# EAGLE design berry_4.0 (EAGLE 6.5.0)
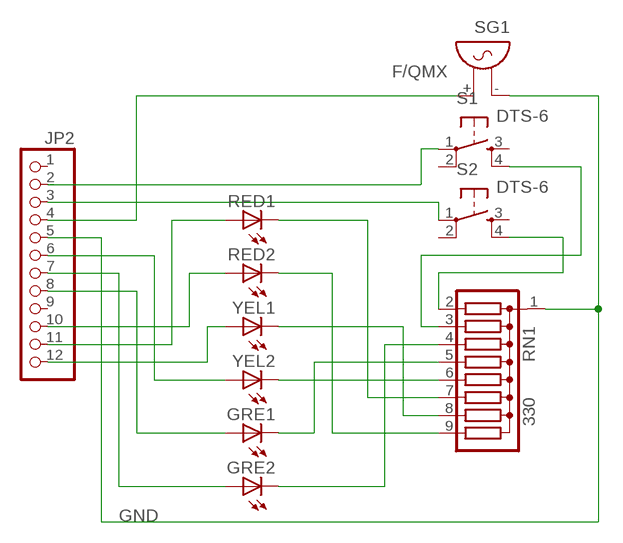
[diagram p0: schematic, sheet 1]

## Parts
GRE1  LED3MM  [LED3MM]
GRE2  LED3MM  [LED3MM]
JP2  PINHD-1X12  [1X12]
RED1  LED3MM  [LED3MM]
RED2  LED3MM  [LED3MM]
RN1  330  G08R  [SIL9]
S1  DTS-6  [DTS-6]
S2  DTS-6  [DTS-6]
SG1  F/QMX  [F/QMX]
YEL1  LED3MM  [LED3MM]
YEL2  LED3MM  [LED3MM]

## Nets
GND: JP2.5 RN1.1 SG1.-
N$1: GRE1.K(C) RN1.5
N$2: JP2.2 S1.1
N$4: RN1.8 YEL1.K(C)
N$6: JP2.10 RED2.A
N$7: RN1.6 YEL2.K(C)
N$8: RED2.K(C) RN1.9
N$9: JP2.4 SG1.+
N$10: RED1.K(C) RN1.7
N$12: GRE2.K(C) RN1.4
N$13: GRE2.A JP2.7
N$14: GRE1.A JP2.8
N$15: RN1.2 S2.4
N$16: RN1.3 S1.4
N$17: JP2.11 RED1.A
N$18: JP2.3 S2.1
N$19: JP2.6 YEL2.A
N$20: JP2.12 YEL1.A
Unconnected: JP2.1 JP2.9 S1.2 S1.3 S2.2 S2.3

## Library data of the parts
GRE1 GRE2 RED1 RED2 YEL1 YEL2 = led:LED: LED OSRAM: - CHIPLED LG R971, LG N971, LY N971, LG Q971, LY Q971, LO R971, LY R971 LH N974, LH R974 LS Q976, LO Q976, LY Q976 LO Q996 - Hyper CHIPLED LW Q18S LB Q993, LB Q99A, LB R99A - SideLED LS A670, LO A670, LY A670, LG A670, LP A670 LB A673, LV A673, LT A673, LW A673 LH A674 LY A675 LS A676, LA A676, LO A676, LY A676, LW A676 LS A679, LY A679, LG A679 - Hyper Micro SIDELED® LS Y876, LA Y876, LO Y876, LY Y876 LT Y87S - SmartLED LW L88C, LW L88S LB L89C, LB L89S, LG L890 LS L89K, LO L89K, LY L89K LS L896, LA L896, LO L896, LY L896 - TOPLED LS T670, LO T670, LY T670, LG T670, LP T670 LSG T670, LSP T670, LSY T670, LOP T670, LYG T670 LG T671, LOG T671, LSG T671 LB T673, LV T673, LT T673, LW T673 LH T674 LS T676, LA T676, LO T676, LY T676, LB T676, LH T676, LSB T676, LW T676 LB T67C, LV T67C, LT T67C, LS T67K, LO T67K, LY T67K, LW E67C LS E67B, LA E67B, LO E67B, LY E67B, LB E67C, LV E67C, LT E67C LW T67C LS T679, LY T679, LG T679 LS T770, LO T770, LY T770, LG T770, LP T770 LB T773, LV T773, LT T773, LW T773 LH T774 LS E675, LA E675, LY E675, LS T675 LS T776, LA T776, LO T776, LY T776, LB T776 LHGB T686 LT T68C, LB T68C - Hyper Mini TOPLED® LB M676 - Mini TOPLED Santana® LG M470 LS M47K, LO M47K, LY M47K Source: http://www.osram.convergy.de LUXEON: - LUMILED® LXK2-PW12-R00, LXK2-PW12-S00, LXK2-PW14-U00, LXK2-PW14-V00 LXK2-PM12-R00, LXK2-PM12-S00, LXK2-PM14-U00 LXK2-PE12-Q00, LXK2-PE12-R00, LXK2-PE12-S00, LXK2-PE14-T00, LXK2-PE14-U00 LXK2-PB12-K00, LXK2-PB12-L00, LXK2-PB12-M00, LXK2-PB14-N00, LXK2-PB14-P00, LXK2-PB14-Q00 LXK2-PR12-L00, LXK2-PR12-M00, LXK2-PR14-Q00, LXK2-PR14-R00 LXK2-PD12-Q00, LXK2-PD12-R00, LXK2-PD12-S00 LXK2-PH12-R00, LXK2-PH12-S00 LXK2-PL12-P00, LXK2-PL12-Q00, LXK2-PL12-R00 Source: www.luxeon.com KINGBRIGHT: KA-3528ASYC Source: www.kingbright.com
JP2 = pinhead:PINHD-1X12: PIN HEADER
RN1 = resistor-sil:G08R: SIL RESISTOR; OC_FARNELL: unknown; OC_NEWARK: unknown
S1 S2 = switch-tact:DTS-6
SG1 = buzzer:F/QMX: BUZZER Source: Buerklin; OC_FARNELL: unknown; OC_NEWARK: unknown

## Board
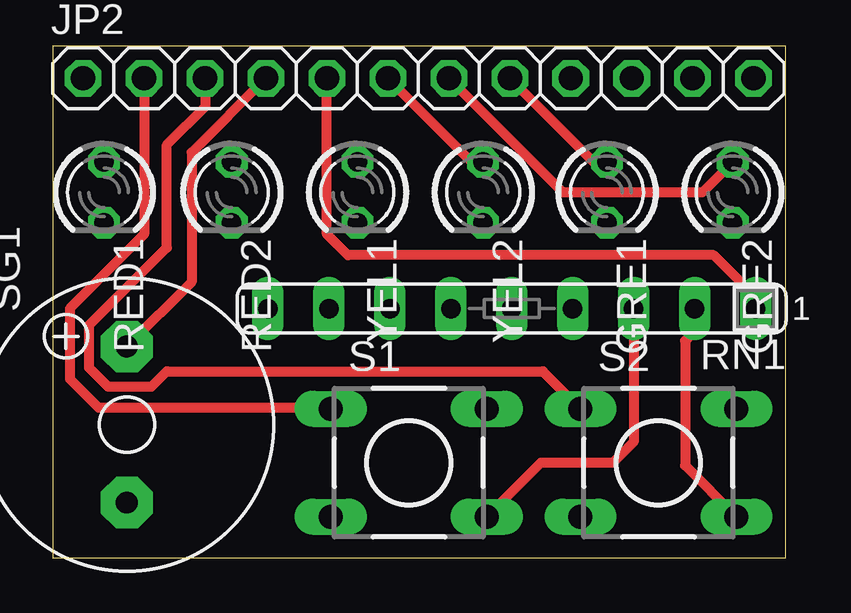
[diagram p1: board, top side]
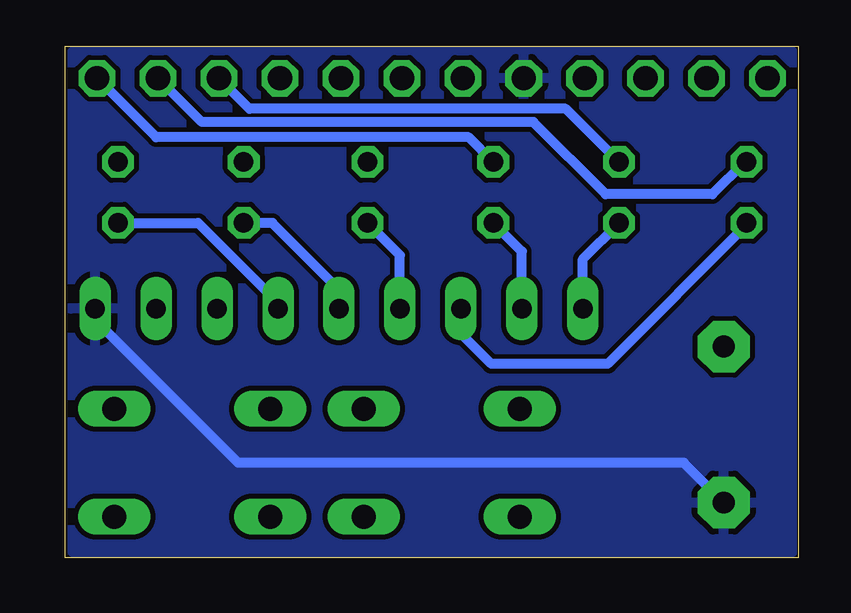
[diagram p2: board, bottom side, seen from below]

No outline drawn. Coordinates in mm, seen from the top.
Copper layers (1*16): Top 0.035mm / dielectric 1.5mm / Bottom 0.035mm
Design rules "default": minimum track width 10mil, minimum drill 24mil, track to track 8mil, track to pad 8mil, pad to pad 8mil, via to via 8mil, smd to smd 8mil, copper to edge 40mil, drill to drill 8mil, minimum pad ring 10mil, minimum via ring 8mil, stop-mask expansion 4mil, vias tented up to drill 0mil, thermal gap 10mil
Milling: 4 lines

### Footprints (pad centres in the part's own frame; a part is rotated, then mirrored left to right if it is on the bottom)
LED3MM = drill 0.813 octagon: A -1.27,0; K 1.27,0
1X12 = drill 1.016 octagon: 1 -13.97,0; 2 -11.43,0; 3 -8.89,0; 4 -6.35,0; 5 -3.81,0; 6 -1.27,0; 7 1.27,0; 8 3.81,0; 9 6.35,0; 10 8.89,0; 11 11.43,0; 12 13.97,0
SIL9 = drill 0.813 long: 1 -10.16,0; 2 -7.62,0; 3 -5.08,0; 4 -2.54,0; 5 0,0; 6 2.54,0; 7 5.08,0; 8 7.62,0; 9 10.16,0
DTS-6 = drill 1 long: 1 -3.25,2.25; 2 3.25,2.25; 3 -3.25,-2.25; 4 3.25,-2.25
F/QMX = drill 0.914 pad 2.159 octagon: + 3.251,0; - -3.251,0

### Placement (x,y rotation side)
GRE1  23.1,15.24 270 top
GRE2  28.34,15.24 270 top
JP2  15.24,20 0 top
RED1  2.14,15.24 270 top
RED2  7.46,15.24 270 top
RN1  19.13,10.4 180 top
S1  14.84,3.97 0 top
S2  25.24,3.97 0 top
SG1  3.1,5.56 90 top
YEL1  12.7,15.24 270 top
YEL2  17.94,15.24 270 top

### Tracks (layer width: path | path; a pad name or v marks a point on that pad's centre or on a via)
GND
  Top 0.406: RN1.1 29.29,10.87 27.54,12.62 12.3,12.62 11.43,13.49 JP2.5
  Bottom 0.406: SG1.- 4.76,3.97 23.34,3.97 29.29,9.92 RN1.1
  pour Bottom: 0.24,21.11 30.24,21.11 30.24,0.24 0.24,0.24
N$1
  Bottom 0.406: RN1.5 19.13,11.19 21.91,13.97 GRE1.K
N$2
  Top 0.406: JP2.2 3.81,13.49 0.71,10.4 0.71,7.46 1.91,6.27 11.54,6.27 S1.1
N$4
  Bottom 0.406: RN1.8 11.51,12.78 YEL1.K
N$6
  Bottom 0.406: RED2.A 9.68,18.73 22.86,18.73 JP2.10
N$7
  Bottom 0.406: RN1.6 16.59,12.62 YEL2.K
N$8
  Bottom 0.406: RN1.9 8.97,12.46 RED2.K
N$9
  Top 0.406: JP2.4 5.79,16.91 5.79,11.51 SG1.+
N$10
  Bottom 0.406: RED1.K 2.14,13.89 7.94,8.1 12.78,8.1 14.05,9.37 RN1.7
N$12
  Bottom 0.406: GRE2.K 25,13.97 21.67,10.64 RN1.4
N$13
  Top 0.406: GRE2.A 27.07,15.24 21.27,15.24 JP2.7
N$14
  Top 0.406: GRE1.A 22.54,16.51 JP2.8
N$15
  Top 0.406: RN1.2 26.75,9.45 26.35,9.05 26.35,3.86 S2.4
N$16
  Top 0.406: RN1.3 24.21,4.84 23.34,3.97 20.34,3.97 S1.4
N$17
  Bottom 0.406: RED1.A 2.22,16.51 3.57,15.16 8.02,15.16 11.03,18.18 24.84,18.18 JP2.11
N$18
  Top 0.406: JP2.3 6.35,18.81 4.76,17.22 4.76,12.94 1.51,9.68 1.51,7.94 2.3,7.14 4.13,7.14 4.76,7.78 20.43,7.78 S2.1
N$19
  Top 0.406: YEL2.A 17.46,16.51 JP2.6
N$20
  Bottom 0.406: YEL1.A 13.73,17.54 26.75,17.54 JP2.12